# EasyEDA schematic TDA2050 Audio Amplifier.json
TITLE: TDA2050 Audio amplifier; REV: 1.0; Date: 2023-12-29; Sheet: 1/1; Company: MrX Circuits
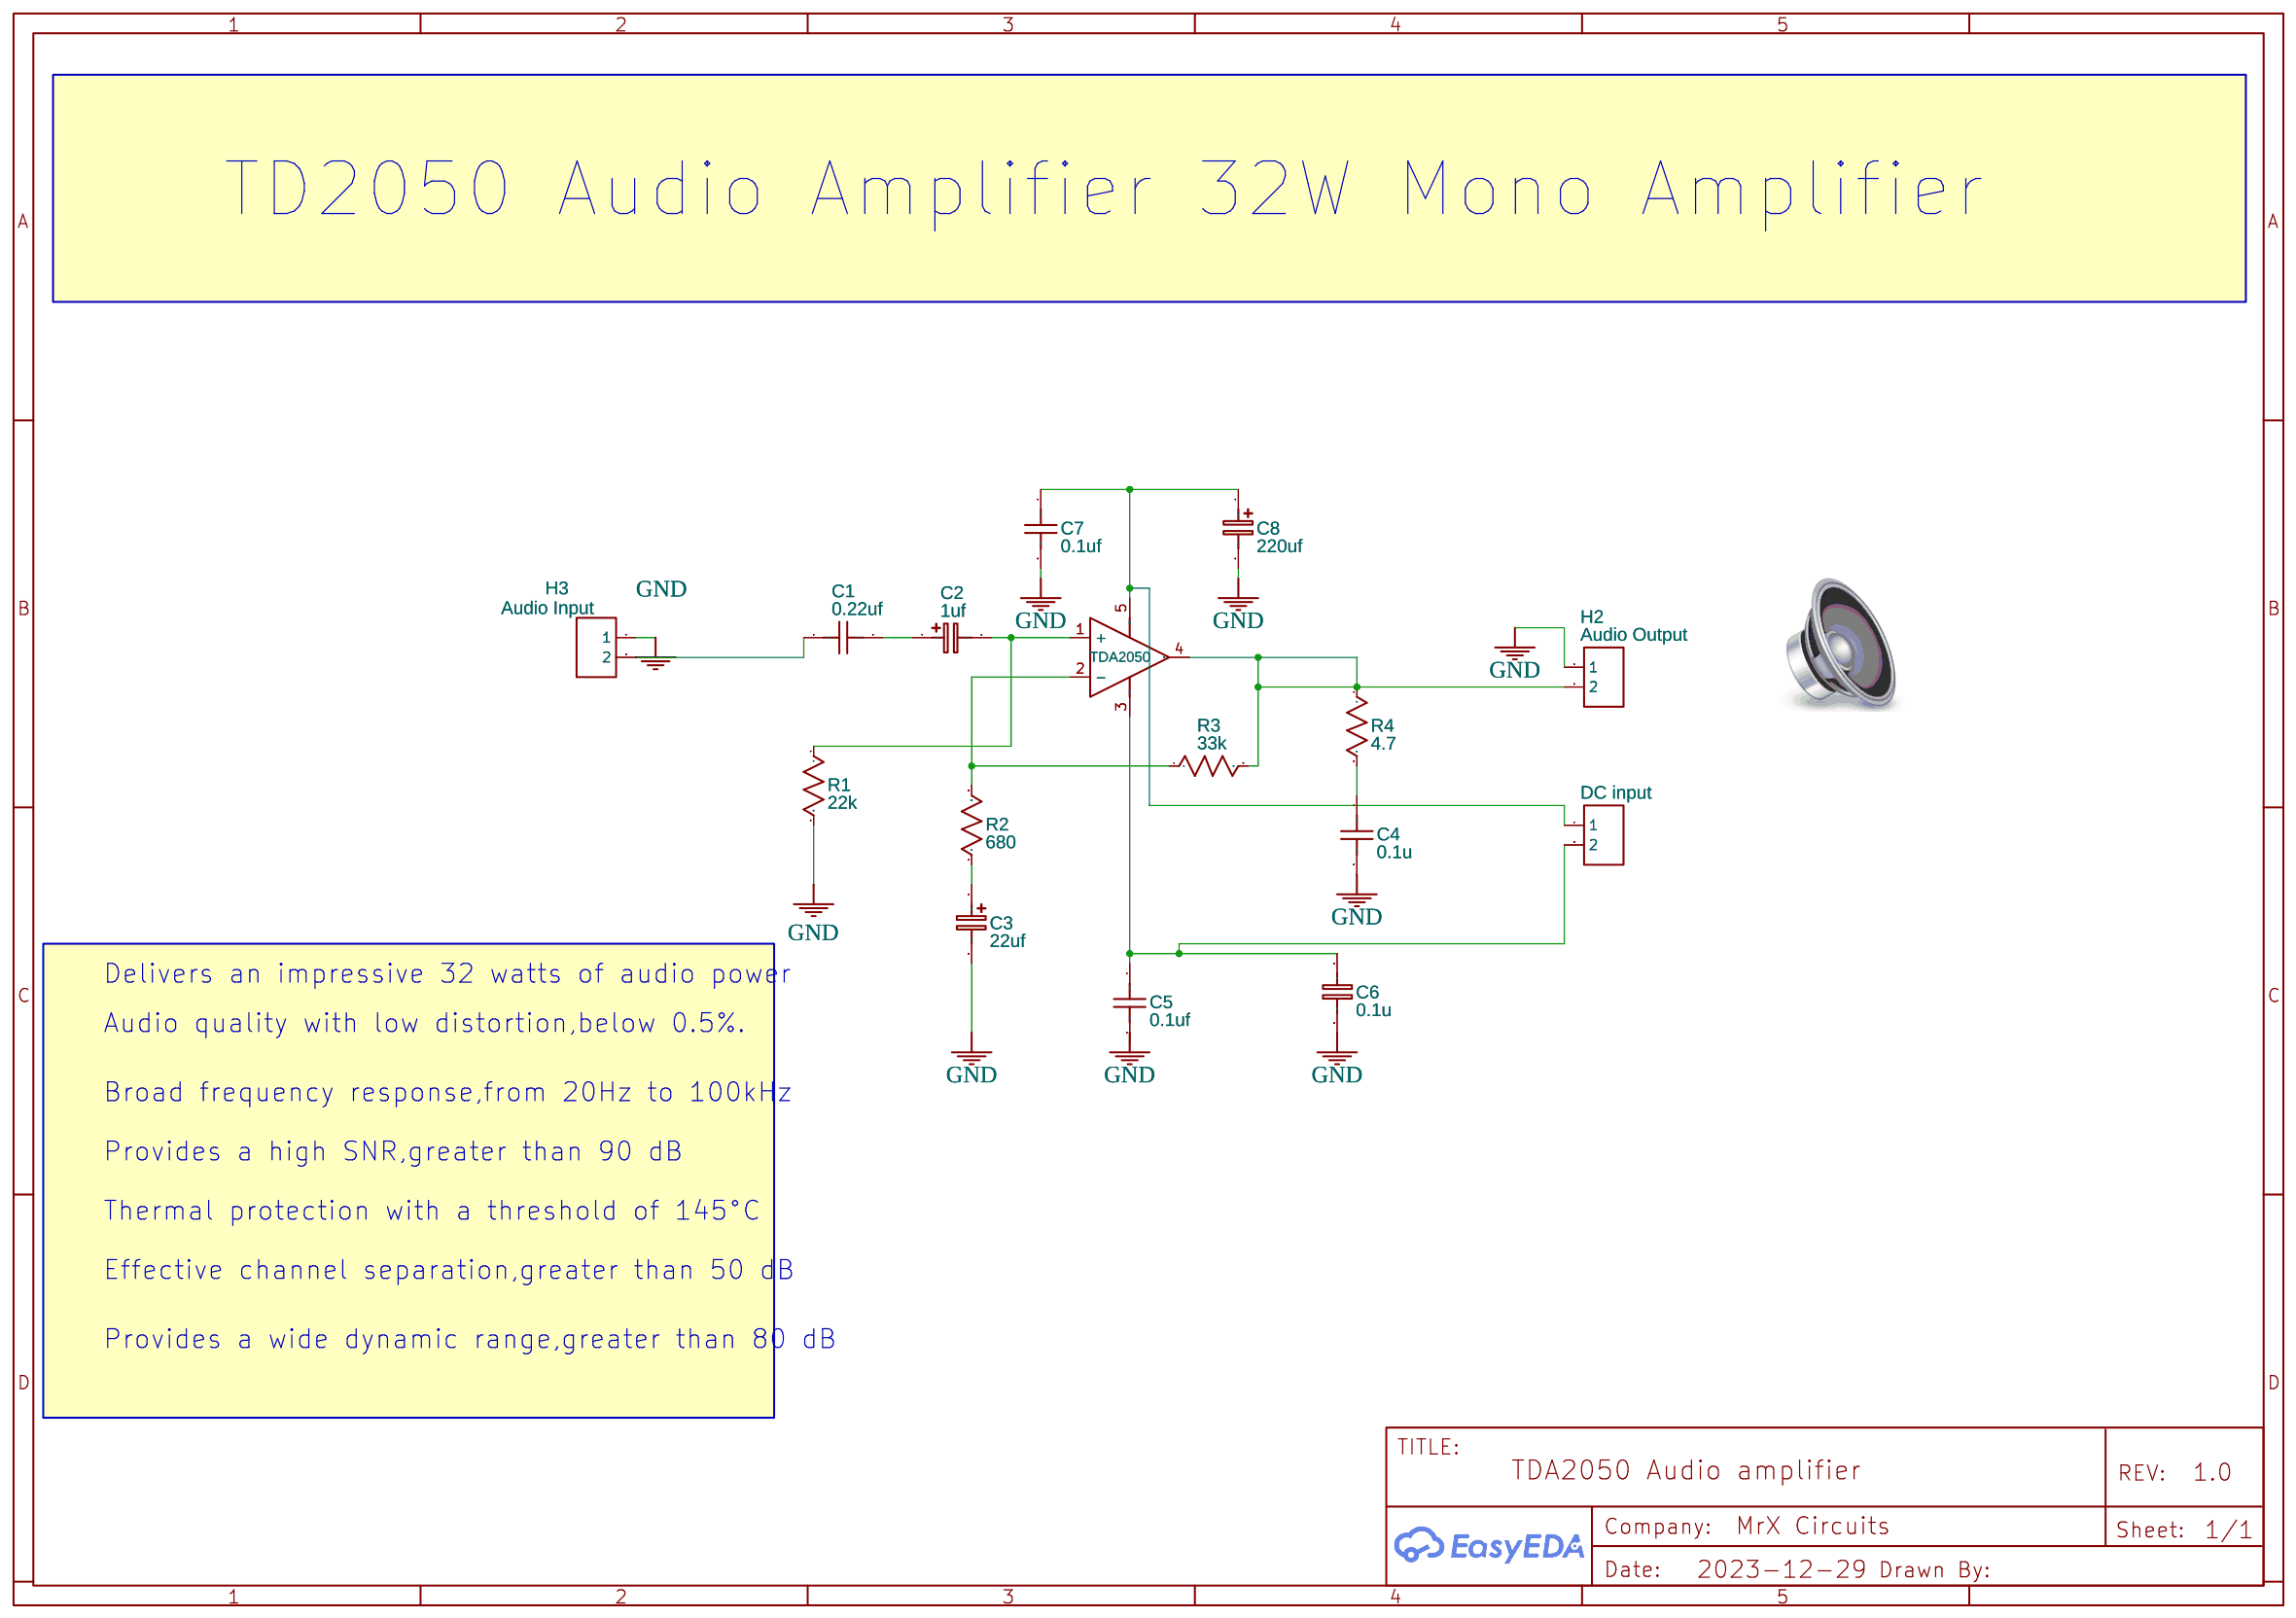
[diagram p0: schematic sheet]

## Parts
C1  0.22uf  [C0603]
C2  1uf  [CASE-E_7343]
C3  22uf  [CASE-E_7343]
C4  0.1u  [C0603]
C5  0.1uf  [C0603]
C6  0.1u  [C0603]
C7  0.1uf  [C0603]
C8  220uf  [CASE-E_7343]
H1  DC input  [HDR-F-2.54_1X2]
H2  Audio Output  [HDR-F-2.54_1X2]
H3  Audio Input  [HDR-F-2.54_1X2]
R1  22k  [R0603]
R2  680  [R0603]
R3  33k  [R0603]
R4  4.7  [R0603]
U1  TDA2050  [TO-220-5_L10.5-W15.5-P1.70-TL]

## Library data of the parts
C1 C4 C5 C7 = C_0603_US: Contributor: LCEDA_Lib
C2 C3 C8 = C_Tan_SMD_E_EU: Contributor: LCEDA_Lib
C6 = C_0603_EU: Contributor: LCEDA_Lib
H1-H3 = HDR-F-2.54_1x2: Supplier Part: C49661; Supplier: LCSC; Contributor: LCEDA_Lib
R1-R4 = R_0603_US: Contributor: LCEDA_Lib
U1 = TDA2050L-TB5-T: Supplier: LCSC; Manufacturer: UTC(友顺); Supplier Part: C84890; JLCPCB Part Class: Extended Part

## Nets
GND: C3.2 C4.2 C5.2 C6.2 C7.2 C8.2 H2.1 H3.1 R1.2
Net-(C1-1): C1.1 H3.2
Net-(C1-2): C1.2 C2.1
Net-(C2-2): C2.2 R1.1 U1.1(+)
Net-(C3-1): C3.1 R2.1
Net-(C4-1): C4.1 R4.2
Net-(C5-1): C5.1 C6.1 H1.2 U1.3(GND)
Net-(C7-1): C7.1 C8.1 H1.1 U1.5(VCC+)
Net-(H2-2): H2.2 R3.2 R4.1 U1.4(OUT)
Net-(R2-2): R2.2 R3.1 U1.2(-)

## Notes on the sheet
- TD2050 Audio Amplifier 32W Mono Amplifier
- Delivers an impressive 32 watts of audio power
- Audio quality with low distortion,below 0.5%.
- Broad frequency response,from 20Hz to 100kHz
- Provides a high SNR,greater than 90 dB
- Thermal protection with a threshold of 145°C
- Effective channel separation,greater than 50 dB
- Provides a wide dynamic range,greater than 80 dB
